# EAGLE design home_automation (EAGLE 7.6.0)
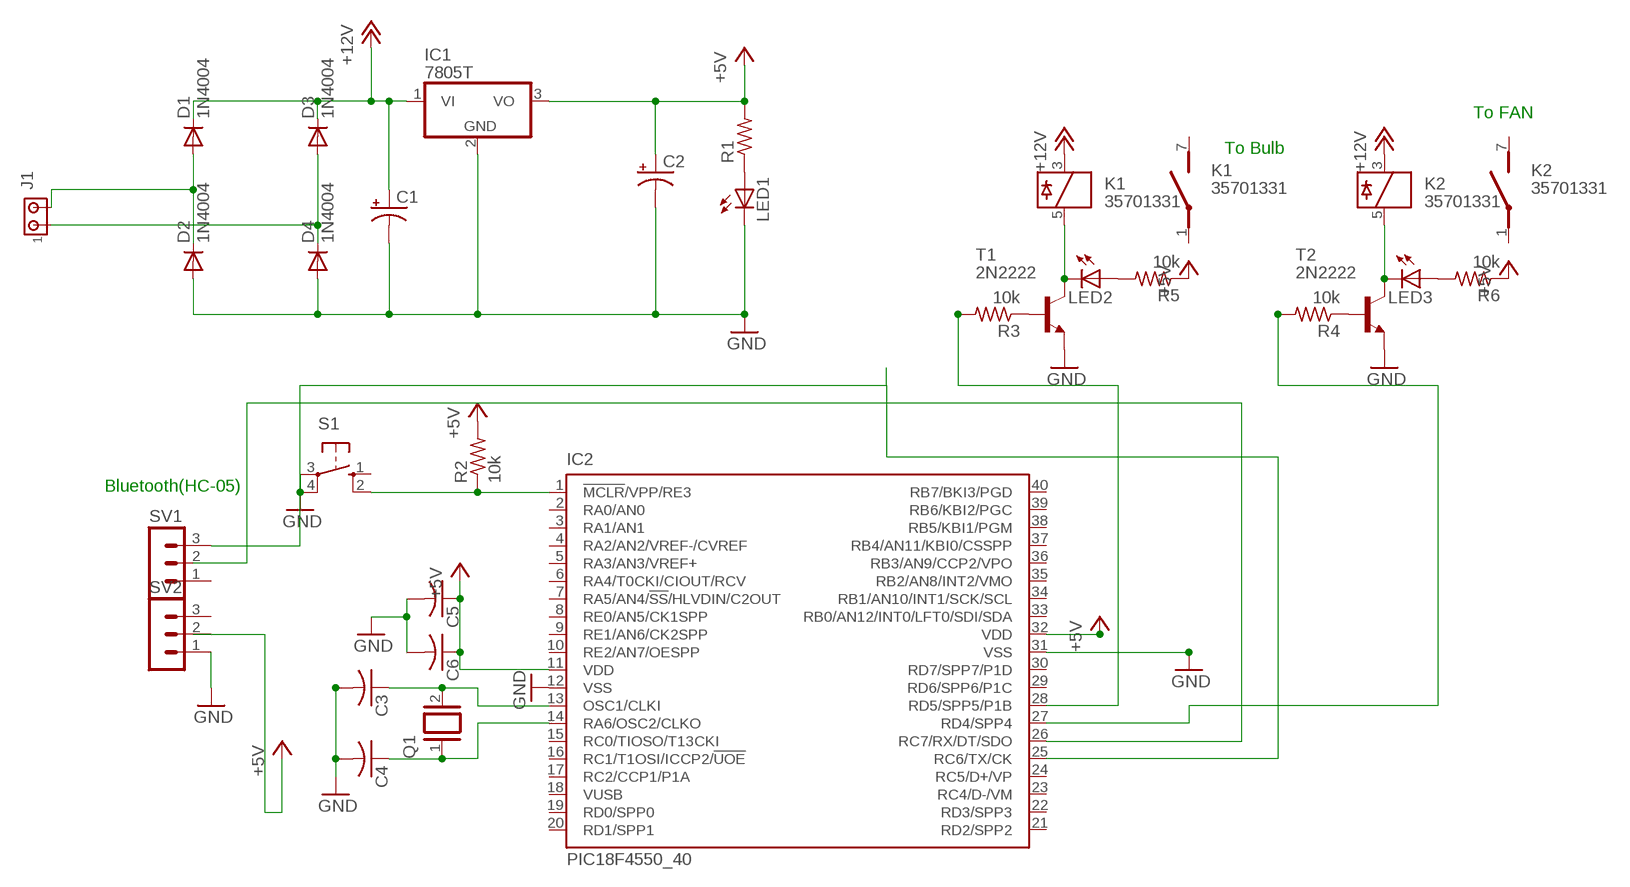
[diagram p0: schematic, sheet 1]

## Parts
C1  CPOL-USE3.5-8  [E3,5-8]
C2  CPOL-USE3.5-8  [E3,5-8]
C3  C-US025-024X044  [C025-024X044]
C4  C-US025-024X044  [C025-024X044]
C5  C-US025-024X044  [C025-024X044]
C6  C-US025-024X044  [C025-024X044]
D1  1N4004  [DO41-10]
D2  1N4004  [DO41-10]
D3  1N4004  [DO41-10]
D4  1N4004  [DO41-10]
IC1  7805T  [TO220H]
IC2  PIC18F4550_40  [DIL40]
J1  MTA02-100  [10X02MTA]
K1  35701331  [REED]
K2  35701331  [REED]
LED1  LED5MM  [LED5MM]
LED2  LED5MM  [LED5MM]
LED3  LED5MM  [LED5MM]
Q1  XTAL/S  [QS]
R1  R-US_0207/10  [0207/10]
R2  10k  R-US_0207/10  [0207/10]
R3  10k  R-US_0207/10  [0207/10]
R4  10k  R-US_0207/10  [0207/10]
R5  10k  R-US_0207/10  [0207/10]
R6  10k  R-US_0207/10  [0207/10]
S1  10-XX  [B3F-10XX]
SV1  MA03-1  [MA03-1]
SV2  MA03-1  [MA03-1]
T1  2N2222  [TO92-EBC-OVAL]
T2  2N2222  [TO92-EBC-OVAL]

## Nets
+5V: C2.+ C5.1 C6.1 IC1.3(VO) IC2.11(VDD) IC2.32(VDD) R1.2 R2.2 R5.1 R6.1
+12V: C1.+ D1.C D3.C IC1.1(VI) K1.3 K2.3
GND: C1.- C2.- C3.2 C4.2 C5.2 C6.2 D2.A D4.A IC1.2(GND) IC2.12(VSS) IC2.31(VSS) LED1.K(C) S1.3(P) S1.4(P1) SV2.1 T1.E T2.E
N$1: IC2.25(RC6/TX/CK) SV1.3
N$2: D1.A D2.C J1.2
N$3: D3.A D4.C J1.1
N$4: C4.1 IC2.14(RA6/OSC2/CLKO) Q1.1
N$5: C3.1 IC2.13(OSC1/CLKI) Q1.2
N$6: LED1.A R1.1
N$7: LED2.A R5.2
N$8: R4.1 T2.B
N$9: K2.5 LED3.K(C) T2.C
N$10: R3.1 T1.B
N$11: IC2.1(!MCLR!/VPP/RE3) R2.1 S1.2(S1)
N$12: LED3.A R6.2
N$13: IC2.27(RD4/SPP4) R4.2
N$14: IC2.26(RC7/RX/DT/SDO)
N$15: K1.5 LED2.K(C) T1.C
N$40: IC2.28(RD5/SPP5/P1B) R3.2
Unconnected: IC2.2(RA0/AN0) IC2.3(RA1/AN1) IC2.4(RA2/AN2/VREF-/CVREF) IC2.5(RA3/AN3/VREF+) IC2.6(RA4/T0CKI/CIOUT/RCV) IC2.7(RA5/AN4/!SS!/HLVDIN/C2OUT) IC2.8(RE0/AN5/CK1SPP) IC2.9(RE1/AN6/CK2SPP) IC2.10(RE2/AN7/OESPP) IC2.15(RC0/TIOSO/T13CKI) IC2.16(RC1/T1OSI/ICCP2/!UOE) IC2.17(RC2/CCP1/P1A) IC2.18(VUSB) IC2.19(RD0/SPP0) IC2.20(RD1/SPP1) IC2.21(RD2/SPP2) IC2.22(RD3/SPP3) IC2.23(RC4/D-/VM) IC2.24(RC5/D+/VP) IC2.29(RD6/SPP6/P1C) IC2.30(RD7/SPP7/P1D) IC2.33(RB0/AN12/INT0/LFT0/SDI/SDA) IC2.34(RB1/AN10/INT1/SCK/SCL) IC2.35(RB2/AN8/INT2/VMO) IC2.36(RB3/AN9/CCP2/VPO) IC2.37(RB4/AN11/KBI0/CSSPP) IC2.38(RB5/KBI1/PGM) IC2.39(RB6/KBI2/PGC) IC2.40(RB7/BKI3/PGD) K1.1(2:P) K1.7(2:S) K2.1(2:P) K2.7(2:S) S1.1(S) SV1.1 SV1.2 SV2.2 SV2.3

## Notes on the sheet
- To FAN
- To Bulb
- Bluetooth(HC-05)

## Library data of the parts
C1 C2 = adafruit:CPOL-US: POLARIZED CAPACITOR, American symbol
C3-C6 = adafruit:C-US: CAPACITOR, American symbol
D1-D4 = diode:1N4004: DIODE general purpose rectifier, 1 A
IC1 = adafruit:78*: Positive VOLTAGE REGULATOR Added bigger pads to the TO-92 package
IC2 = microchip:PIC18F4*_40: USB Microcontrollers with nanoWatt Technology High-Performance, Enhanced Flash, 28/40/44-Pin, Source: http://ww1.microchip.com/downloads/en/devicedoc/39632c.pdf; MF: MICROCHIP; MPN: PIC18F4550-I/P; OC_FARNELL: 9321357; OC_NEWARK: 74K8623
J1 = con-amp:MTA02-100: AMP connector
K1 K2 = relay:35701331: RELAY reed, 1 x norm. open with polarity; OC_FARNELL: unknown; OC_NEWARK: unknown
LED1-LED3 = adafruit:LED: LED OSRAM: - CHIPLED LG R971, LG N971, LY N971, LG Q971, LY Q971, LO R971, LY R971 LH N974, LH R974 LS Q976, LO Q976, LY Q976 LO Q996 - Hyper CHIPLED LW Q18S LB Q993, LB Q99A, LB R99A - SideLED LS A670, LO A670, LY A670, LG A670, LP A670 LB A673, LV A673, LT A673, LW A673 LH A674 LY A675 LS A676, LA A676, LO A676, LY A676, LW A676 LS A679, LY A679, LG A679 - Hyper Micro SIDELED® LS Y876, LA Y876, LO Y876, LY Y876 LT Y87S - SmartLED LW L88C, LW L88S LB L89C, LB L89S, LG L890 LS L89K, LO L89K, LY L89K LS L896, LA L896, LO L896, LY L896 - TOPLED LS T670, LO T670, LY T670, LG T670, LP T670 LSG T670, LSP T670, LSY T670, LOP T670, LYG T670 LG T671, LOG T671, LSG T671 LB T673, LV T673, LT T673, LW T673 LH T674 LS T676, LA T676, LO T676, LY T676, LB T676, LH T676, LSB T676, LW T676 LB T67C, LV T67C, LT T67C, LS T67K, LO T67K, LY T67K, LW E67C LS E67B, LA E67B, LO E67B, LY E67B, LB E67C, LV E67C, LT E67C LW T67C LS T679, LY T679, LG T679 LS T770, LO T770, LY T770, LG T770, LP T770 LB T773, LV T773, LT T773, LW T773 LH T774 LS E675, LA E675, LY E675, LS T675 LS T776, LA T776, LO T776, LY T776, LB T776 LHGB T686 LT T68C, LB T68C - Hyper Mini TOPLED® LB M676 - Mini TOPLED Santana® LG M470 LS M47K, LO M47K, LY M47K Source: http://www.osram.convergy.de/
Q1 = special:XTAL/S: CRYSTAL
R1-R6 = adafruit:R-US_: RESISTOR, American symbol
S1 = switch-omron:10-XX: OMRON SWITCH; MPN: B3F-1000; OC_FARNELL: 176432; OC_NEWARK: 36M3542
SV1 SV2 = con-lstb:MA03-1: PIN HEADER; OC_FARNELL: unknown; OC_NEWARK: unknown
T1 T2 = adafruit:2N2222: NPN TRANSISTOR Big oval pads

## Board
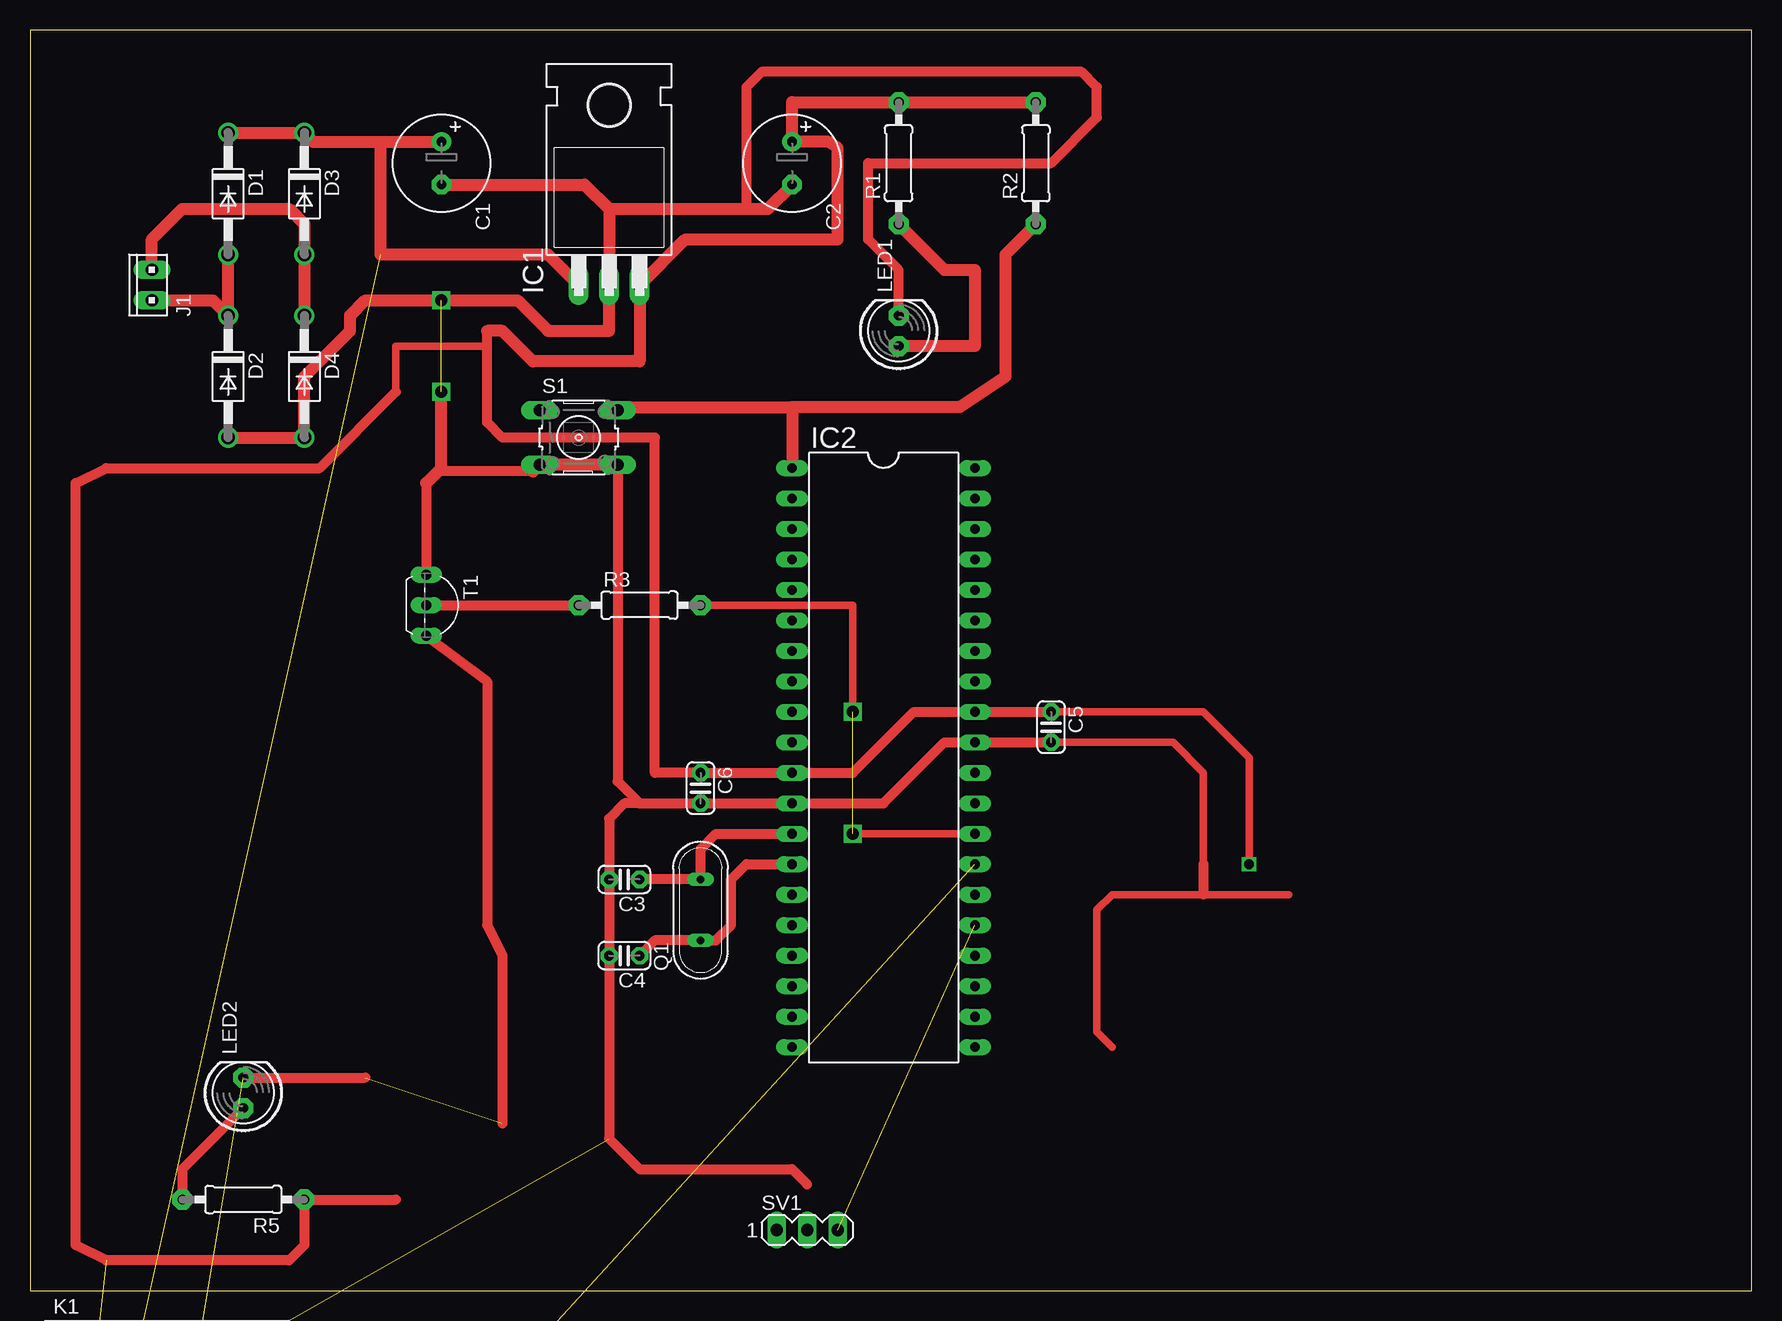
[diagram p1: board, top side]
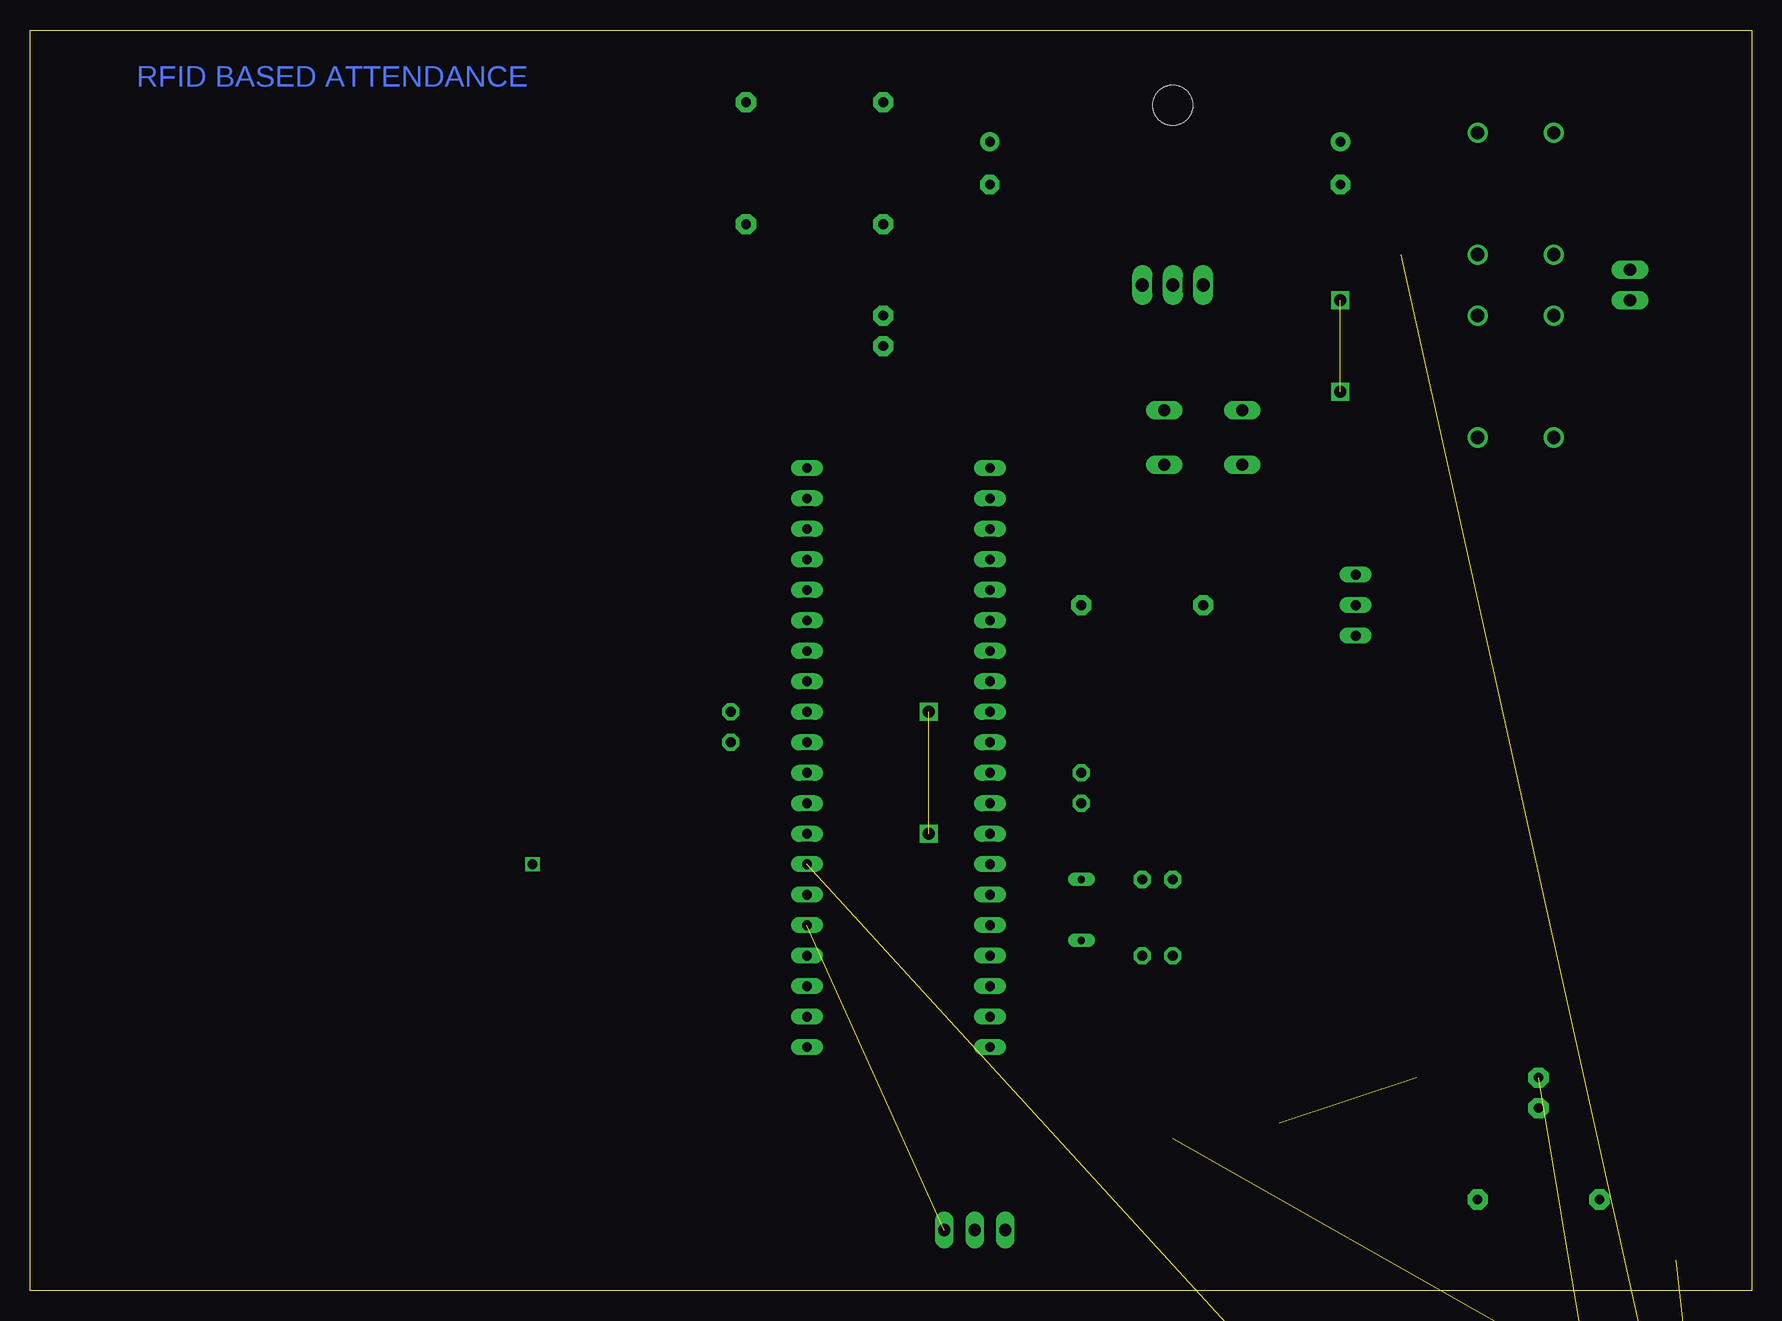
[diagram p2: board, bottom side, seen from below]

Size 143.49 x 105.08 mm. Coordinates in mm from the lower left corner, seen from the top.
Outline: 0,0 143.49,0 143.49,105.08 0,105.08 0,0
Copper layers (1*16): Top 0.035mm / dielectric 1.5mm / Bottom 0.035mm
Design rules "default": minimum track width 10mil, minimum drill 24mil, track to track 8mil, track to pad 8mil, pad to pad 8mil, via to via 8mil, smd to smd 8mil, copper to edge 40mil, drill to drill 8mil, minimum pad ring 10mil, minimum via ring 8mil, stop-mask expansion 4mil, vias tented up to drill 0mil, thermal gap 10mil

### Footprints (pad centres in the part's own frame; a part is rotated, then mirrored left to right if it is on the bottom)
E3,5-8 = drill 0.813 pad 1.6: + -1.778,0 | drill 0.813 pad 1.6 octagon: - 1.778,0
C025-024X044 = drill 0.813 pad 1.422 octagon: 1 -1.27,0; 2 1.27,0
DO41-10 = drill 1.118: A 5.08,0; C -5.08,0
TO220H = drill 1.118 long: 1 -2.54,-10.16; 2 0,-10.16; 3 2.54,-10.16 | hole 3.302: 0,4.826
DIL40 = drill 0.813 long: 1 -24.13,-7.62; 2 -21.59,-7.62; 3 -19.05,-7.62; 4 -16.51,-7.62; 5 -13.97,-7.62; 6 -11.43,-7.62; 7 -8.89,-7.62; 8 -6.35,-7.62; 9 -3.81,-7.62; 10 -1.27,-7.62; 11 1.27,-7.62; 12 3.81,-7.62; 13 6.35,-7.62; 14 8.89,-7.62; 15 11.43,-7.62; 16 13.97,-7.62; 17 16.51,-7.62; 18 19.05,-7.62; 19 21.59,-7.62; 20 24.13,-7.62; 21 24.13,7.62; 22 21.59,7.62; 23 19.05,7.62; 24 16.51,7.62; 25 13.97,7.62; 26 11.43,7.62; 27 8.89,7.62; 28 6.35,7.62; 29 3.81,7.62; 30 1.27,7.62; 31 -1.27,7.62; 32 -3.81,7.62; 33 -6.35,7.62; 34 -8.89,7.62; 35 -11.43,7.62; 36 -13.97,7.62; 37 -16.51,7.62; 38 -19.05,7.62; 39 -21.59,7.62; 40 -24.13,7.62
10X02MTA = drill 1.016 long: 1 1.27,0; 2 -1.27,0
REED = drill 0.813 long: 1 -17.78,2.54; 3 -12.7,2.54; 5 -7.62,2.54; 7 -2.54,2.54
LED5MM = drill 0.813 pad 1.676 octagon: A -1.27,0; K 1.27,0
QS = drill 0.61 long: 1 -2.54,0; 2 2.54,0
0207/10 = drill 0.813 pad 1.676 octagon: 1 -5.08,0; 2 5.08,0
B3F-10XX = drill 1.016 long: 1 -3.251,2.261; 2 3.251,2.261; 3 -3.251,-2.261; 4 3.251,-2.261
MA03-1 = drill 1.016 long: 1 -2.54,0; 2 0,0; 3 2.54,0
TO92-EBC-OVAL = drill 0.813 long: B 0,-1.27; C 2.54,-1.27; E -2.54,-1.27

### Placement (x,y rotation side)
C1  34.29,93.98 270 top
C2  63.5,93.98 270 top
C3  49.53,34.29 180 top
C4  49.53,27.94 180 top
C5  85.09,46.99 270 top
C6  55.88,41.91 270 top
D1  16.51,91.44 270 top
D2  16.51,76.2 270 top
D3  22.86,91.44 270 top
D4  22.86,76.2 270 top
IC1  48.26,93.98 0 top
IC2  71.12,44.45 270 top
J1  10.16,83.82 90 top
K1  21.59,-7.62 0 top  (outside the outline)
K2  21.59,-25.4 0 top  (outside the outline)
LED1  72.39,80.01 90 top
LED2  17.78,16.51 90 top
LED3  3.81,-30.48 0 top  (outside the outline)
Q1  55.88,31.75 90 top
R1  72.39,93.98 90 top
R2  83.82,93.98 90 top
R3  50.8,57.15 0 top
R4  6.35,-38.1 0 top  (outside the outline)
R5  17.78,7.62 180 top
R6  6.35,-43.18 0 top  (outside the outline)
S1  45.72,71.12 0 top
SV1  64.77,5.08 0 top
SV2  6.35,-48.26 0 top  (outside the outline)
T1  34.29,57.15 270 top
T2  3.81,-12.7 0 top  (outside the outline)

### Tracks (layer width: path | path; a pad name or v marks a point on that pad's centre or on a via)
+5V  (via drill 0.8)  (1 unrouted)
  Top 0.61: C5.1 97.79,48.26 101.6,44.45 v101.6,35.56 | 30.48,74.93 30.48,78.74 38.1,78.74
  Top 0.813: C5.1 IC2.32 73.66,48.26 68.58,43.18 IC2.11 C6.1 52.07,43.18 52.07,71.12 39.37,71.12 38.1,72.39 38.1,78.74 38.1,80.01 | 30.48,74.93 24.13,68.58 6.35,68.58 3.81,67.31 3.81,3.81 6.35,2.54 21.59,2.54 22.86,3.81 R5.1 30.48,7.62
  Top 1.016: R2.2 R1.2 63.5,99.06 C2.+ 66.55,95.76 67.31,95.25 67.31,87.63 54.61,87.63 IC1.3 50.8,77.47 41.91,77.47 39.37,80.01 38.1,80.01
+12V  (2 unrouted)
  Top 1.016: D1.C D3.C 23.62,95.76 29.21,95.76 | 29.21,95.76 C1.+ | IC1.1 43.18,86.36 29.21,86.36 29.21,95.76
GND  (via drill 1)  (3 unrouted)
  Top 0.61: C5.2 95.25,45.72 97.79,43.18 97.79,35.56 | 104.9,33.02 97.79,33.02 90.17,33.02 88.9,31.75 88.9,21.59 90.17,20.32
  Top 0.813: C5.2 IC2.31 76.2,45.72 71.12,40.64 IC2.12 C6.2 50.8,40.64 | 41.91,68.3 34.01,68.3 33.02,67.31 T1.E | S1.4 48.97,42.47 50.8,40.64 | 50.8,40.64 49.53,40.64 48.26,39.37 C3.2 C4.2 48.26,12.7 50.8,10.16 63.5,10.16 64.77,8.89 | LED1.K 72.39,85.09 69.85,87.63 69.85,93.98 85.09,93.98 88.9,97.79 88.9,100.33 87.63,101.6 60.96,101.6 59.69,100.33 59.69,90.17 | 97.79,35.56 97.79,33.02
  Top 1.016: D2.A D4.A 22.86,76.2 26.67,80.01 26.67,81.28 27.94,82.55 v34.29,82.55 40.64,82.55 43.18,80.01 48.26,80.01 IC1.2 48.26,90.17 | C1.- 46.23,92.2 48.26,90.17 | 48.26,90.17 59.69,90.17 61.47,90.17 C2.- | S1.4 S1.3 41.91,68.3 | 33.02,67.31 34.29,68.58 v34.29,74.93
N$1  (1 unrouted)
N$2
  Top 1.016: J1.2 15.24,82.55 D2.C D1.A
N$3
  Top 1.016: J1.1 10.16,87.63 12.7,90.17 21.59,90.17 22.86,88.9 D3.A D4.C
N$4
  Top 0.813: IC2.14 59.69,35.56 58.42,34.29 58.42,30.48 57.15,29.21 Q1.1 52.07,29.21 C4.1
N$5
  Top 0.813: IC2.13 57.15,38.1 55.88,36.83 Q1.2 C3.1
N$6
  Top 1.016: R1.1 76.2,85.09 78.74,85.09 78.74,78.74 LED1.A
N$7
  Top 0.813: LED2.A 12.7,10.16 R5.2
N$8  (1 unrouted)
N$9  (2 unrouted)
N$10
  Top 0.813: T1.B R3.1
N$11
  Top 1.016: R2.1 81.28,86.36 81.28,76.2 77.47,73.66 63.5,73.66 | 63.5,73.66 IC2.1 | S1.2 49.96,73.66 63.5,73.66
N$12  (1 unrouted)
N$13  (1 unrouted)
N$15  (2 unrouted)
  Top 0.813: T1.C 38.1,50.8 38.1,30.48 39.37,27.94 39.37,13.97 | LED2.K 27.94,17.78
N$40  (via drill 1)  (1 unrouted)
  Top 0.61: R3.2 68.58,57.15 v68.58,48.26 | v68.58,38.1 IC2.28

### Text on the board
Bottom: RFID BASED ATTENDANCE